# EAGLE design dps-relay (EAGLE 9.5.0)
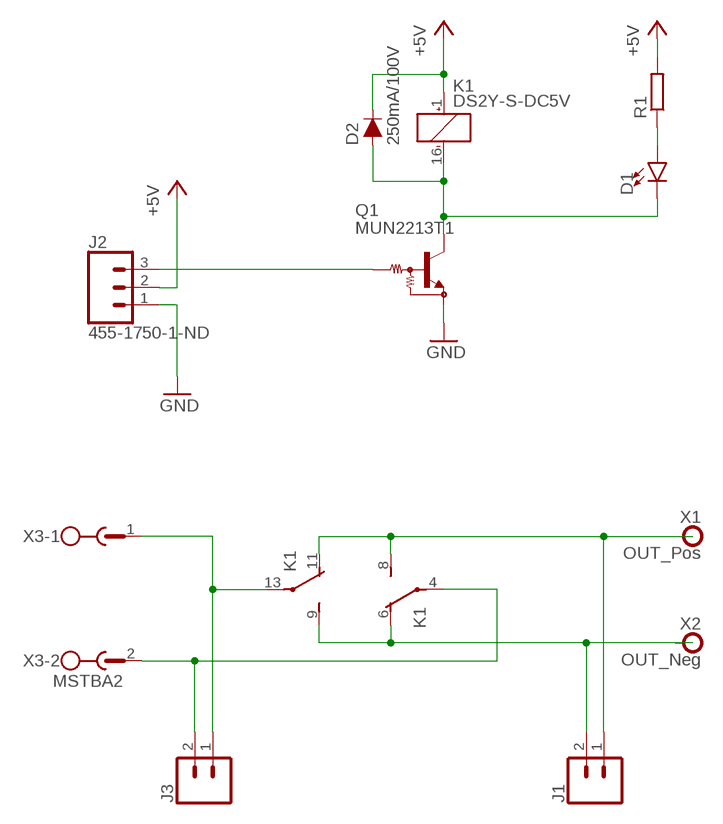
[diagram p0: schematic, sheet 1]

## Parts
D1  LED3MM  [LED_3MM]
D2  250mA/100V  DIODE-BAS16J  [SOD-323]
J1  CONN_02  [1X02]
J2  455-1750-1-ND  CONN_03  [1X03]
J3  CONN_02  [1X02]
K1  DS2Y-S-DC5V  [DS2Y]
Q1  MUN2213T1  [SC59-BEC]
R1  R-EU_R1206  [R1206]
X1  OUT_Pos  SOCKET_24.243  [SOCKET_24.243]
X2  OUT_Neg  SOCKET_24.243  [SOCKET_24.243]
X3  MSTBA2  [MSTBA2]

## Nets
+5V: D2.C J2.2 K1.1(1:+) R1.2
GND: J2.1 Q1.E
IN_N: J3.1 K1.13(3:P) X3.1
IN_P: J3.2 K1.4(2:P) X3.2
N$5: D1.A R1.1
OUT_N: J1.1 K1.8(2:S) K1.11(3:O) X1.1(P) X1.2(P)
OUT_P: J1.2 K1.6(2:O) K1.9(3:S) X2.1(P) X2.2(P)
Q1_C: D1.K(C) D2.A K1.16(1:-) Q1.C
RIN: J2.3 Q1.B

## Library data of the parts
D1 = SparkFun-LED:LED: LED (Generic) Standard schematic elements and footprints for 5mm, 3mm, 1206, and 0603 sized LEDs. Generic LEDs with no color specified.; PROD_ID: DIO-08794
D2 = SparkFun-DiscreteSemi:DIODE: Diode These are standard reverse protection diodes and small signal diodes. SparkFun Products: SparkFun SparkPunk Sound Kit <https://www.sparkfun.com/products/11177> SparkFun ESP8266 Thing <https://www.sparkfun.com/products/13231>; PROD_ID: DIO-09646
J1 J3 = SparkFun-Connectors:CONN_02: Multi connection point. Often used as Generic Header-pin footprint for 0.1 inch spaced/style header connections On any of the 0.1 inch spaced packages, you can populate with these: Break Away Headers - Straight <https://www.sparkfun.com/products/116> (PRT-00116) Break Away Male Headers - Right Angle <https://www.sparkfun.com/products/553> (PRT-00553) Female Headers <https://www.sparkfun.com/products/115> (PRT-00115) Break Away Headers - Machine Pin <https://www.sparkfun.com/products/117> (PRT-00117) Break Away Female Headers - Swiss Machine Pin <https://www.sparkfun.com/products/743> (PRT-00743) For SCREWTERMINALS and SPRING TERMINALS visit here: Screw Terimnals on SparkFun.com <https://www.sparkfun.com/search/results?term=Screw+Terminals> (5mm/3.5mm/2.54mm spacing) This device is also useful as a general connection point to wire up your design to another part of your project. Our various solder wires solder well into these plated through hole pads. Hook-Up Wire - Assortment (Stranded, 22 AWG) <https://www.sparkfun.com/products/11375> (PRT-11375) Hook-Up Wire - Assortment (Solid Core, 22 AWG) <https://www.sparkfun.com/products/11367> (PRT-11367) View the entire wire category on our website here <https://www.sparkfun.com/categories/141> Special notes: Molex polarized connector foot print use with: PRT-08233 with associated crimp pins and housings. 2.54_SCREWTERM for use with PRT-10571. 3.5mm Screw Terminal footprints for PRT-08084 5mm Screw Terminal footprints for use with PRT-08432
J2 = SparkFun-Connectors:CONN_03: Multi connection point. Often used as Generic Header-pin footprint for 0.1 inch spaced/style header connections On any of the 0.1 inch spaced packages, you can populate with these: Break Away Headers - Straight <https://www.sparkfun.com/products/116> (PRT-00116) Break Away Male Headers - Right Angle <https://www.sparkfun.com/products/553> (PRT-00553) Female Headers <https://www.sparkfun.com/products/115> (PRT-00115) Break Away Headers - Machine Pin <https://www.sparkfun.com/products/117> (PRT-00117) Break Away Female Headers - Swiss Machine Pin <https://www.sparkfun.com/products/743> (PRT-00743) Stackable Header - 3 Pin (Female, 0.1") <https://www.sparkfun.com/products/13875> (PRT-13875) For SCREWTERMINALS and SPRING TERMINALS visit here: Screw Terimnals on SparkFun.com <https://www.sparkfun.com/search/results?term=Screw+Terminals> (5mm/3.5mm/2.54mm spacing) This device is also useful as a general connection point to wire up your design to another part of your project. Our various solder wires solder well into these plated through hole pads. Hook-Up Wire - Assortment (Stranded, 22 AWG) <https://www.sparkfun.com/products/11375> (PRT-11375) Hook-Up Wire - Assortment (Solid Core, 22 AWG) <https://www.sparkfun.com/products/11367> (PRT-11367) View the entire wire category on our website here <https://www.sparkfun.com/categories/141> Special notes: Molex polarized connector foot print use with SKU : PRT-08232 with associated crimp pins and housings.; PROD_ID: XXX-00000
K1 = dps-ralay-lib:DS2Y-S-DC*: MINIATURE RELAY NAiS Source: http://www.mew-europe.com/.. en_ds_61005_0023.pdf; MPN: DS2Y-S-DC5V; OC_FARNELL: unknown; OC_NEWARK: 13P3268
Q1 = transistor-npn:MUN2213*: NPN Bias Resistor Transistor
R1 = rcl:R-EU_: RESISTOR, European symbol; SPICEPREFIX: R
X1 X2 = dps-ralay-lib:SOCKET_24.243
X3 = con-phoenix-508:MSTBA2: PHOENIX; MF: FARNELL; MPN: 1757242; OC_FARNELL: 3705171; OC_NEWARK: 71C4161

## Board
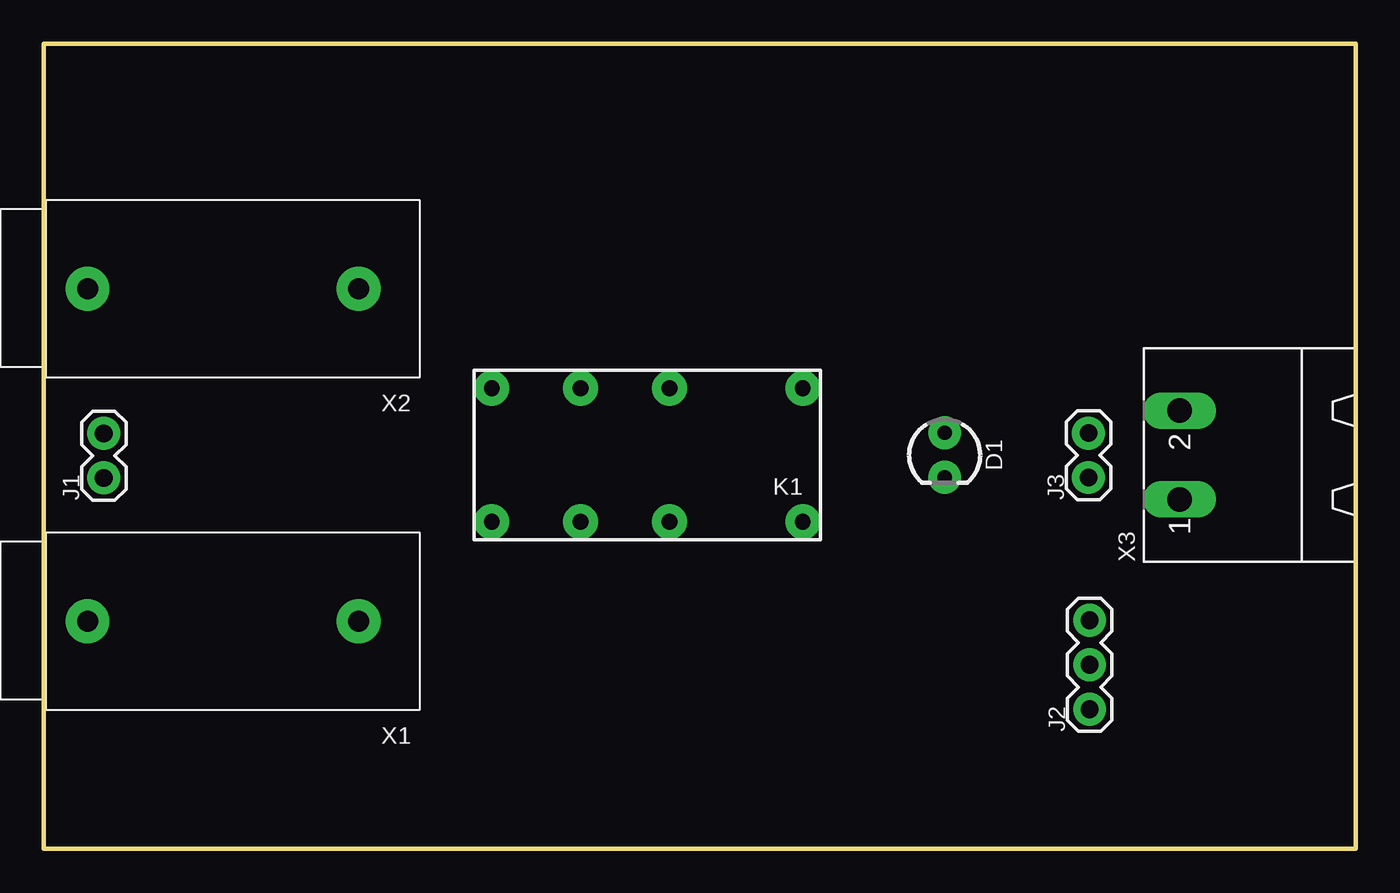
[diagram p1: board, top side]
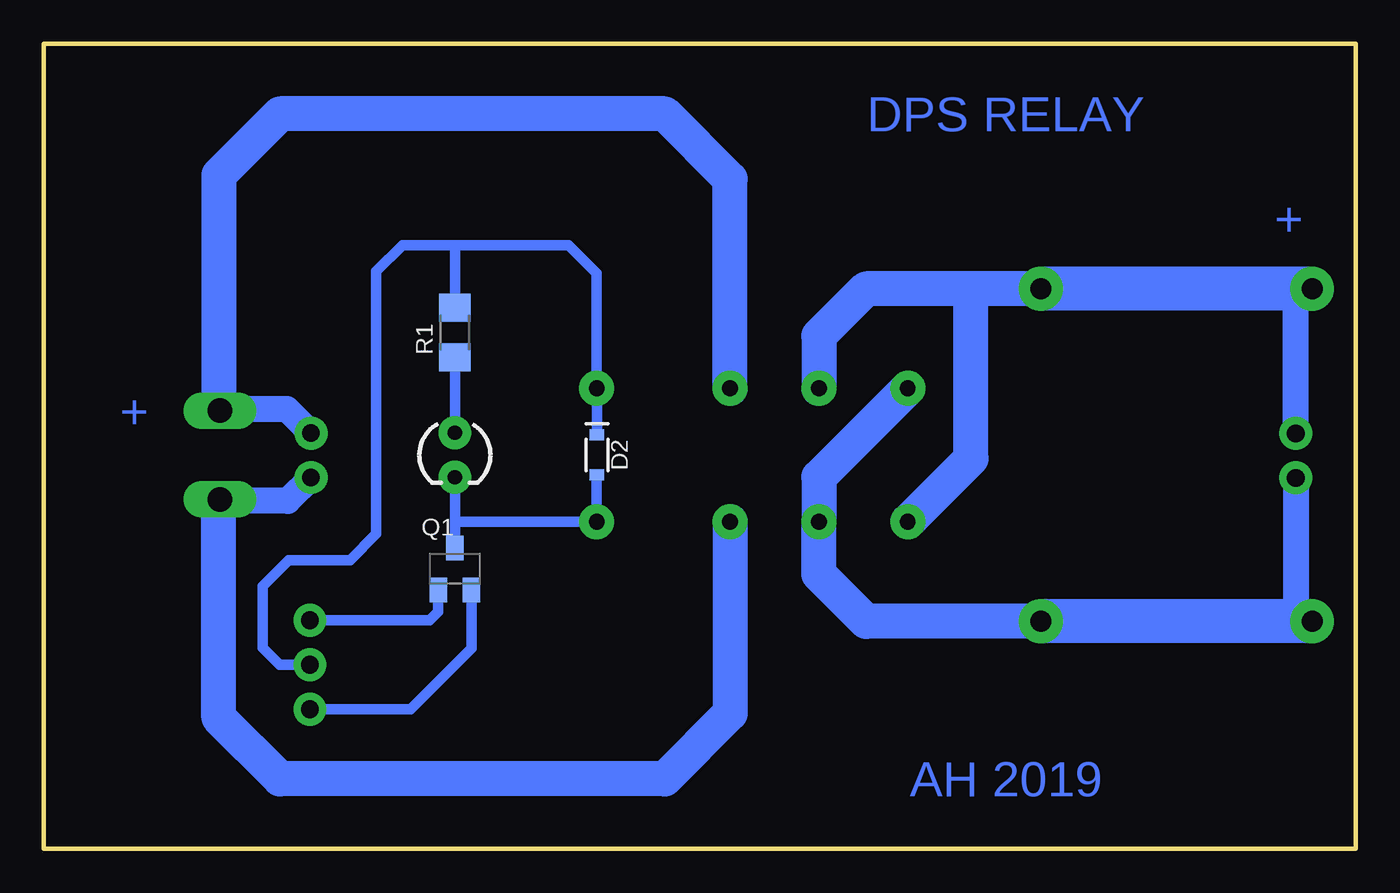
[diagram p2: board, bottom side, seen from below]

Size 75 x 46 mm. Coordinates in mm from the lower left corner, seen from the top.
Outline: 0,0 75,0 75,46 0,46 0,0
Copper layers (1*16): Top 0.035mm / dielectric 1.5mm / Bottom 0.035mm
Design rules "default *": minimum track width 10mil, minimum drill 0.5mm, track to track 10mil, track to pad 10mil, pad to pad 10mil, via to via 10mil, smd to smd 10mil, copper to edge 40mil, drill to drill 6mil, minimum pad ring 10mil, minimum via ring 8mil, stop-mask expansion 4mil, vias tented up to drill 0mil, thermal gap 10mil

### Footprints (pad centres in the part's own frame; a part is rotated, then mirrored left to right if it is on the bottom)
LED_3MM = drill 0.813 pad 1.88: A -1.27,0; K 1.27,0
SOD-323 = smd 0.63 x 0.83: A 1.15,0; C -1.15,0
1X02 = drill 1.016 pad 1.88: 1 0,0; 2 2.54,0
1X03 = drill 1.016 pad 1.88: 1 0,0; 2 2.54,0; 3 5.08,0
DS2Y = drill 0.9 pad 2: 1 -8.89,-3.81; 4 -1.27,-3.81; 6 3.81,-3.81; 8 8.89,-3.81; 9 8.89,3.81; 11 3.81,3.81; 13 -1.27,3.81; 16 -8.89,3.81
SC59-BEC = smd 1 x 1.4: B -0.95,-1.2; C 0,1.2; E 0.95,-1.2
R1206 = smd 1.6 x 1.803: 1 -1.422,0; 2 1.422,0
SOCKET_24.243 = drill 1.2 pad 2.5: 1 0,0; 2 15.5,0
MSTBA2 = drill 1.397 long: 1 -2.54,5.08; 2 2.54,5.08

### Placement (x,y rotation side)
D1  51.5,22.5 270 top
D2  43.38,22.51 270 bottom
J1  3.43,21.19 90 top
J2  59.78,7.97 90 top
J3  59.72,21.21 90 top
K1  34.5,22.5 180 top
Q1  51.5,16 0 bottom
R1  51.5,29.5 90 bottom
X1  18,13 180 top
X2  18,32 180 top
X3  70,22.5 90 top

### Tracks (layer width: path | path; a pad name or v marks a point on that pad's centre or on a via)
+5V
  Bottom 0.61: J2.2 61.51,10.51 62.5,11.5 62.5,15 61,16.5 57.5,16.5 56,18 56,33 54.5,34.5 51.5,34.5 | 51.5,34.5 45,34.5 43.39,32.89 K1.1 43.38,26.3 D2.C | R1.2 51.5,34.5
GND
  Bottom 0.61: J2.1 54.03,7.97 50.55,11.45 Q1.E
IN_N
  Bottom 1.5: X3.1 65,19.88 61.06,19.88 J3.1
  Bottom 2: K1.13 35.77,7.73 39.5,4 61.5,4 65,7.5 65,19.88
IN_P
  Bottom 1.5: X3.2 65,25.12 61.09,25.12 J3.2
  Bottom 2: K1.4 35.77,38.27 39.5,42 61.5,42 65,38.5 65,25.12
N$5
  Bottom 0.61: R1.1 D1.A
OUT_N
  Bottom 1.5: J1.1 3.43,13 X1.2
  Bottom 2: X1.1 28,13 30.69,15.69 K1.11 30.69,21.23 K1.8
  Bottom 2.5: X1.2 X1.1
OUT_P
  Bottom 1.5: J1.2 3.43,32 4,32
  Bottom 2: X2.1 22,32 | 22,32 28,32 30.69,29.31 K1.6 | K1.9 22,22.3 22,32
  Bottom 2.5: X2.2 4,32 X2.1
Q1_C
  Bottom 0.5: 43.38,18.7 K1.16
  Bottom 0.61: D2.A K1.16 51.5,18.69 | Q1.C 51.5,18.69 | D1.K 51.5,18.69
RIN
  Bottom 0.61: J2.3 52.95,13.05 52.45,13.55 Q1.B

### Text on the board
Bottom: DPS RELAY | + | + | AH 2019